# EAGLE design Qwiic_Relay (EAGLE 9.2.0)
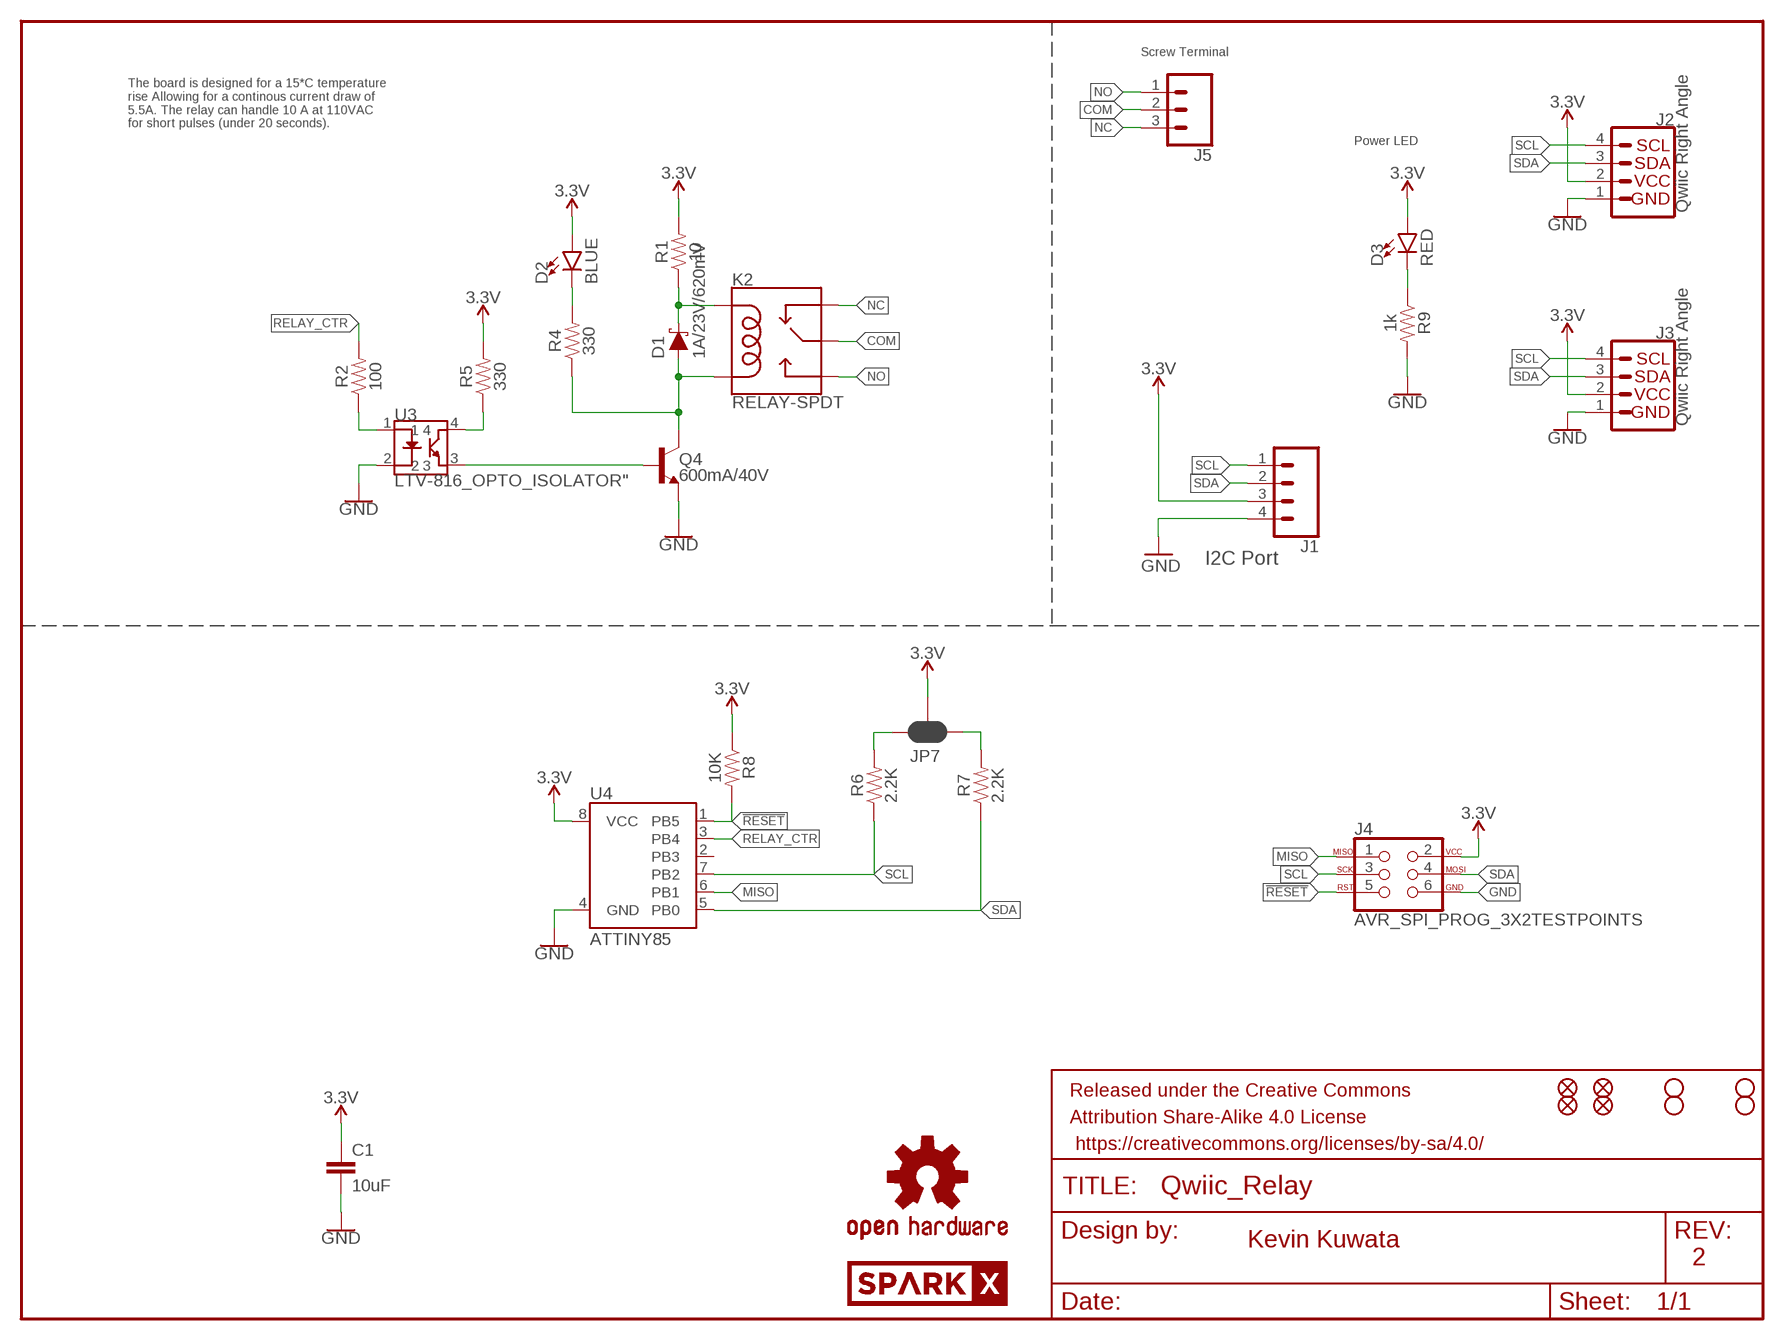
[diagram p0: schematic, sheet 1]

## Parts
C1  10uF  10UF-0603-6.3V-20%  [0603]
D1  1A/23V/620mV  DIODE-SCHOTTKY-BAT20J  [SOD-323]
D2  BLUE  LED-BLUE0603  [LED-0603]
D3  RED  LED-RED0603  [LED-0603]
FRAME1  FRAME-LETTER  [CREATIVE_COMMONS]
J1  CONN_041X04_NO_SILK  [1X04_NO_SILK]
J2  Qwiic Right Angle  I2C_STANDARDQWIIC  [1X04_1MM_RA]
J3  Qwiic Right Angle  I2C_STANDARDQWIIC  [1X04_1MM_RA]
J4  AVR_SPI_PROG_3X2TESTPOINTS  [2X3_TEST_POINTS]
J5  CONN_03-SCREW-5MM  [SCREWTERMINAL-5MM-3]
JP1  STAND-OFF  [STAND-OFF]
JP2  FIDUCIALUFIDUCIAL  [MICRO-FIDUCIAL]
JP3  STAND-OFF  [STAND-OFF]
JP4  STAND-OFF  [STAND-OFF]
JP5  STAND-OFF  [STAND-OFF]
JP6  FIDUCIALUFIDUCIAL  [MICRO-FIDUCIAL]
JP7  JUMPER-SMT_3_2-NC_PASTE_SILK  [SMT-JUMPER_3_2-NC_PASTE_SILK]
JP8  FIDUCIALUFIDUCIAL  [MICRO-FIDUCIAL]
JP9  FIDUCIALUFIDUCIAL  [MICRO-FIDUCIAL]
K2  RELAY-SPDT  [RELAY_G5LE]
LOGO1  OSHW-LOGOMINI  [OSHW-LOGO-MINI]
Q4  600mA/40V  TRANS_NPN-MMBT2222AL  [SOT23-3]
R1  10  47KOHM-0603-1/10W-1%  [0603]
R2  100  100OHM-0603-1/4W-5%  [0603]
R4  330  300OHM-0603-1/10W-1%  [0603]
R5  330  330OHM-0603-1/10W-1%  [0603]
R6  2.2K  4.7KOHM-0603-1/10W-1%  [0603]
R7  2.2K  4.7KOHM-0603-1/10W-1%  [0603]
R8  10K  330OHM-0603-1/10W-1%  [0603]
R9  1k  330OHM-0603-1/10W-1%  [0603]
U3  LTV-816_OPTO_ISOLATOR"  [LTV-816_4PIN_DIP]
U4  ATTINY85  [ATTINY85]
U$3  SPARKX-LOGO4  [SPARKX-MEDIUM]
U$4  SPARKX-LOGO4  [SPARKX-MEDIUM]

## Nets
3.3V: C1.1 D2.A D3.A J1.3 J2.2 J3.2 J4.2 JP7.2 R1.2 R5.2 R8.1 U4.8(VCC)
!RESET: J4.5 R8.2 U4.1(PB5)
COM: J5.2 K2.1(MAIN)
GND: C1.2 J1.4 J2.1 J3.1 J4.6 Q4.2(E) R9.2 U3.2 U4.4(GND)
MISO: J4.1 U4.6(PB1)
N$1: Q4.1(B) U3.3
N$2: D1.A K2.5(COIL2) Q4.3(C) R4.1
N$3: R2.1 U3.1
N$4: JP7.1 R7.2
N$7: D1.C K2.2(COIL1) R1.1
N$8: D2.C R4.2
N$9: R5.1 U3.4
N$10: JP7.3 R6.2
N$13: D3.C R9.1
NC: J5.3 K2.4(NC)
NO: J5.1 K2.3(NO)
RELAY_CTR: R2.2 U4.3(PB4)
SCL: J1.1 J2.4 J3.4 J4.3 R6.1 U4.7(PB2)
SDA: J1.2 J2.3 J3.3 J4.4 R7.1 U4.5(PB0)
Unconnected: U4.2(PB3)

## Notes on the sheet
- Screw Terminal
- The board is designed for a 15*C temperature 
  rise Allowing for a continous current draw of 
  5.5A. The relay can handle 10 A at 110VAC 
  for short pulses (under 20 seconds).
- Power LED
- I2C Port
- Kevin Kuwata
- 2

## Library data of the parts
C1 = SparkFun-Capacitors:10UF: 10.0µF ceramic capacitors A capacitor is a passive two-terminal electrical component used to store electrical energy temporarily in an electric field.; PROD_ID: CAP-11015
D1 = SparkFun-DiscreteSemi:DIODE-SCHOTTKY: Schottky diode A Schottky diode is a semiconductor diode which has a low forward voltage drop and a very fast switching action.; PROD_ID: DIO-11623
D2 = SparkFun-LED:LED-BLUE: Blue SMD LED Used in manufacturing of various products at SparkFun Packages: 0603 - SMD 0603 package [Product Link] <http://www.digikey.com/product-detail/en/SMLE12BC7TT86/511-1589-2-ND/1641808> 1206 - SMD1206 package [Product Link] <http://www.digikey.com/product-detail/en/lite-on-inc/LTST-C150TBKT/160-1643-1-ND/573584> SparkFun Products: ESP8266 Thing-Dev Board <https://www.sparkfun.com/products/13711> RedBoard <https://www.sparkfun.com/products/12757>; PROD_ID: DIO-08575
D3 = SparkFun-LED:LED-RED: Red SMD LED Used in manufacturing of most products at SparkFun Packages: 0603 - SMD 0603 package [Product Link] <http://docs.avagotech.com/docs/AV02-0551EN> 0603 SMART - SMD 0603 SMART package ( more efficient and expensive)[Product Link] <http://www.osram-os.com/Graphics/XPic2/00077099_0.pdf> 1206 - SMD1206 package [Product Link] <https://www.sparkfun.com/datasheets/DevTools/LilyPad/Q150OVS4.pdff> SparkFun Products: Pro Mini 328 -5V <https://www.sparkfun.com/products/821> RedBoard <https://www.sparkfun.com/products/12757> IOIO-OTG <https://www.sparkfun.com/products/13613>; PROD_ID: DIO-00819
FRAME1 = SparkFun-Aesthetics:FRAME-LETTER: Schematic Frame - Letter Standard 8.5x11 US Letter frame
J1 = SparkFun-Connectors:CONN_04: Multi connection point. Often used as Generic Header-pin footprint for 0.1 inch spaced/style header connections On any of the 0.1 inch spaced packages, you can populate with these: Break Away Headers - Straight <https://www.sparkfun.com/products/116> (PRT-00116) Break Away Male Headers - Right Angle <https://www.sparkfun.com/products/553> (PRT-00553) Female Headers <https://www.sparkfun.com/products/115> (PRT-00115) Break Away Headers - Machine Pin <https://www.sparkfun.com/products/117> (PRT-00117) Break Away Female Headers - Swiss Machine Pin <https://www.sparkfun.com/products/743> (PRT-00743) For SCREWTERMINALS and SPRING TERMINALS visit here: Screw Terimnals on SparkFun.com <https://www.sparkfun.com/search/results?term=Screw+Terminals> (5mm/3.5mm/2.54mm spacing) This device is also useful as a general connection point to wire up your design to another part of your project. Our various solder wires solder well into these plated through hole pads. Hook-Up Wire - Assortment (Stranded, 22 AWG) <https://www.sparkfun.com/products/11375> (PRT-11375) Hook-Up Wire - Assortment (Solid Core, 22 AWG) <https://www.sparkfun.com/products/11367> (PRT-11367) View the entire wire category on our website here <https://www.sparkfun.com/categories/141> Special notes: Molex polarized connector foot print use with SKU : PRT-08231 with associated crimp pins and housings. 1MM SMD Version SKU: PRT-10208; PROD_ID: CONN-09696
J2 J3 = SparkFun-Connectors:I2C_STANDARD: SparkFun I2C Standard Pinout Header SparkFun has standardized on a pinout for all I2C based sensor breakouts. This pinout allows I2C boards to be plugged directly into the headers on Arduino Uno compatible boards, and to be daisy chained easily. Example SparkFun Products: SparkFun Atmospheric Sensor Breakout - BME280 <https://www.sparkfun.com/products/13676> SparkFun Altitude/Pressure Sensor Breakout - MPL3115A2 <https://www.sparkfun.com/products/11084> SparkFun TOF Range Finder Sensor - VL6180 <https://www.sparkfun.com/products/12785>; PROD_ID: CONN-13694
J4 = SparkFun-Connectors:AVR_SPI_PROG_3X2: AVR ISP 6 Pin This is the reduced ISP connector for AVR programming. Common on Arduino. This footprint will take up less PCB space and can be used with a 10-pin to 6-pin adapter such as SKU: BOB-08508 **Special note about "TEST_POINT" package. The stop mask is on the top side, so if you want your programming test points to be on the bottom of your board, make sure to place this package on the bottom side of the board. This also ensure that the orientation to program from the bottom side will be correct. SparkFun Products: SparkFun ISP Pogo Adapter <https://www.sparkfun.com/products/11591> - NS Tiny AVR Programmer <https://www.sparkfun.com/products/11801> -PTH
J5 = SparkFun-Connectors:CONN_03: Multi connection point. Often used as Generic Header-pin footprint for 0.1 inch spaced/style header connections On any of the 0.1 inch spaced packages, you can populate with these: Break Away Headers - Straight <https://www.sparkfun.com/products/116> (PRT-00116) Break Away Male Headers - Right Angle <https://www.sparkfun.com/products/553> (PRT-00553) Female Headers <https://www.sparkfun.com/products/115> (PRT-00115) Break Away Headers - Machine Pin <https://www.sparkfun.com/products/117> (PRT-00117) Break Away Female Headers - Swiss Machine Pin <https://www.sparkfun.com/products/743> (PRT-00743) Stackable Header - 3 Pin (Female, 0.1") <https://www.sparkfun.com/products/13875> (PRT-13875) For SCREWTERMINALS and SPRING TERMINALS visit here: Screw Terimnals on SparkFun.com <https://www.sparkfun.com/search/results?term=Screw+Terminals> (5mm/3.5mm/2.54mm spacing) This device is also useful as a general connection point to wire up your design to another part of your project. Our various solder wires solder well into these plated through hole pads. Hook-Up Wire - Assortment (Stranded, 22 AWG) <https://www.sparkfun.com/products/11375> (PRT-11375) Hook-Up Wire - Assortment (Solid Core, 22 AWG) <https://www.sparkfun.com/products/11367> (PRT-11367) View the entire wire category on our website here <https://www.sparkfun.com/categories/141> Special notes: Molex polarized connector foot print use with SKU : PRT-08232 with associated crimp pins and housings.; PROD_ID: CONN-10134; SF_SKU: PRT-08433
JP1 JP3-JP5 = SparkFun:STAND-OFF: Stand Off This is the mechanical footprint for a #4 phillips button head screw. Use the keepout ring to avoid running the screw head into surrounding components. SKU : PRT-00447
JP2 JP6 JP8 JP9 = SparkFun:FIDUCIAL: Fiducial Alignment Points Various fiducial points for machine vision alignment.
JP7 = SparkFun-Jumpers:JUMPER-SMT_3_2-NC_PASTE: Normally closed solder jumper (2 of 2 connections) This jumper has an aperture in the stencil to allow solder paste to bridge both connections. Both connections are normally closed (NC). Wick off the solder to open the connection(s). Reapply solder to reclose the connection(s).
K2 = SparkFun-Electromechanical:RELAY-SPDT: SPDT Electromechanical Relay Single-pole, double-throw sealed relays. When current is applied to the coil, it throws a simple changeover switch, terminating the connection from the NC contact to ground and closing the NO contact. Use them to switch high voltage/high current devices. SparkFun Products JQX-15F: Relay SPDT Sealed - 20A <https://www.sparkfun.com/products/10924> (COM-10924) JZC-11F: Relay SPDT Sealed <https://www.sparkfun.com/products/100> (COM-00100); PROD_ID: COM-14146
LOGO1 = SparkFun-Aesthetics:OSHW-LOGO: Open-Source Hardware (OSHW) Logo This logo indicates the piece of hardware it is found on incorporates a OSHW license and/or adheres to the definition of open source hardware found here: http://freedomdefined.org/OSHW
Q4 = SparkFun-DiscreteSemi:TRANS_NPN: NPN transistor Current controlled devices typically used to amplify current or used as a switch. BC547 - COM-08928 <http://www.sparkfun.com/products/8928> (TO-92 45V 100mA) (1.Collector 2.Base 3.Emitter) 2N3904 - COM-00521 <http://www.sparkfun.com/products/521> (TO-92 40V 200mA) (1.Emitter 2.Base 3.Collector) P2N2222A - COM-12852 <http://www.sparkfun.com/products/12852> (TO-92 40V 600mA) (1.Collector 2.Base 3.Emitter); PROD_ID: TRANS-08049
R1 = SparkFun-Resistors:47KOHM: 47kΩ resistor A resistor is a passive two-terminal electrical component that implements electrical resistance as a circuit element. Resistors act to reduce current flow, and, at the same time, act to lower voltage levels within circuits. - Wikipedia; PROD_ID: RES-07871; VALUE: 47k
R2 = SparkFun-Resistors:100OHM: 100Ω resistor A resistor is a passive two-terminal electrical component that implements electrical resistance as a circuit element. Resistors act to reduce current flow, and, at the same time, act to lower voltage levels within circuits. - Wikipedia; PROD_ID: RES-12438
R4 = SparkFun-Resistors:300OHM: 300Ω resistor A resistor is a passive two-terminal electrical component that implements electrical resistance as a circuit element. Resistors act to reduce current flow, and, at the same time, act to lower voltage levels within circuits. - Wikipedia; PROD_ID: RES_10328; VALUE: 300
R5 = SparkFun-Resistors:330OHM: 330Ω resistor A resistor is a passive two-terminal electrical component that implements electrical resistance as a circuit element. Resistors act to reduce current flow, and, at the same time, act to lower voltage levels within circuits. - Wikipedia; PROD_ID: RES-00818
R6 R7 = SparkFun-Resistors:4.7KOHM: 4.7kΩ resistor A resistor is a passive two-terminal electrical component that implements electrical resistance as a circuit element. Resistors act to reduce current flow, and, at the same time, act to lower voltage levels within circuits. - Wikipedia; PROD_ID: RES-07857; VALUE: 4.7k
R8 R9 = SparkFun-Resistors:330OHM: 330Ω resistor A resistor is a passive two-terminal electrical component that implements electrical resistance as a circuit element. Resistors act to reduce current flow, and, at the same time, act to lower voltage levels within circuits. - Wikipedia; PROD_ID: RES-00818; VALUE: 330
U3 = SparkFun-DiscreteSemi:LTV-816_OPTO_ISOLATOR; PROD_ID: IC-14145
U4 = SparkFun-IC-Microcontroller:ATTINY85; PROD_ID: IC-09092
U$3 U$4 = SparkX:SPARKX-LOGO

## Board
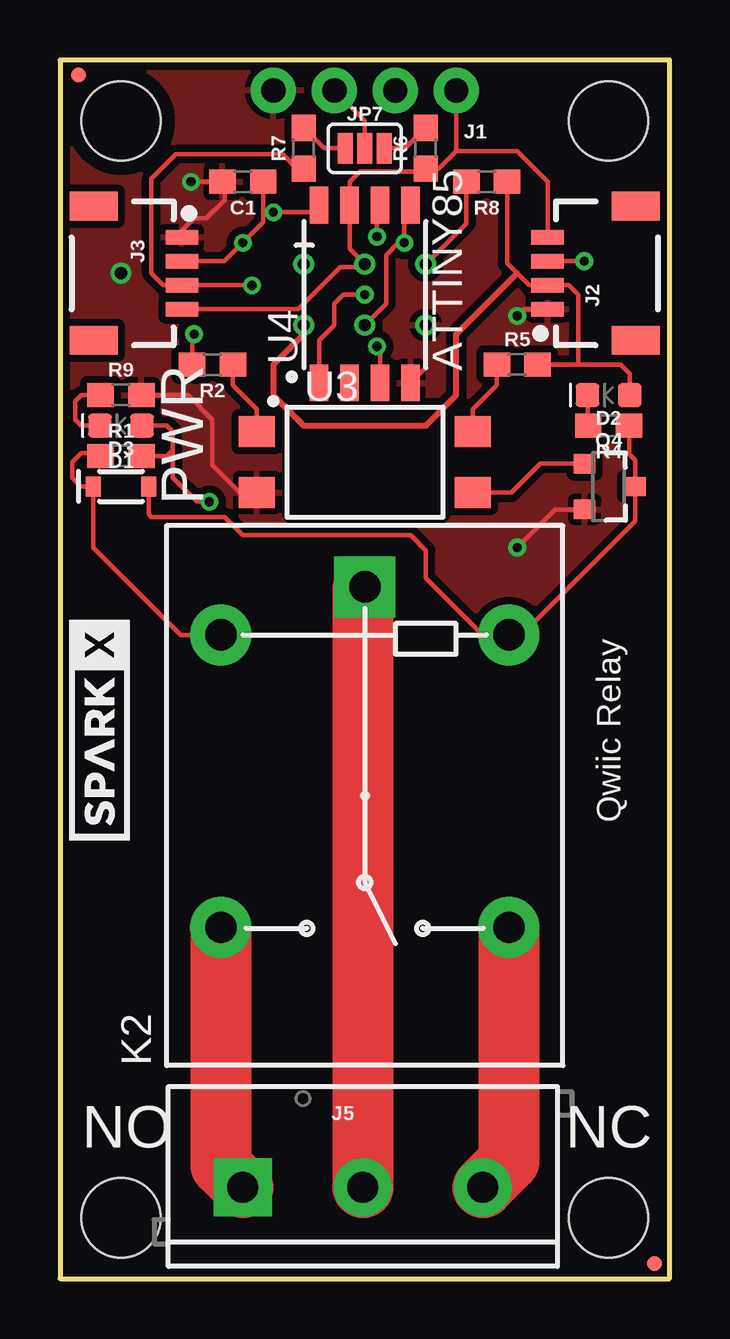
[diagram p1: board, top side]
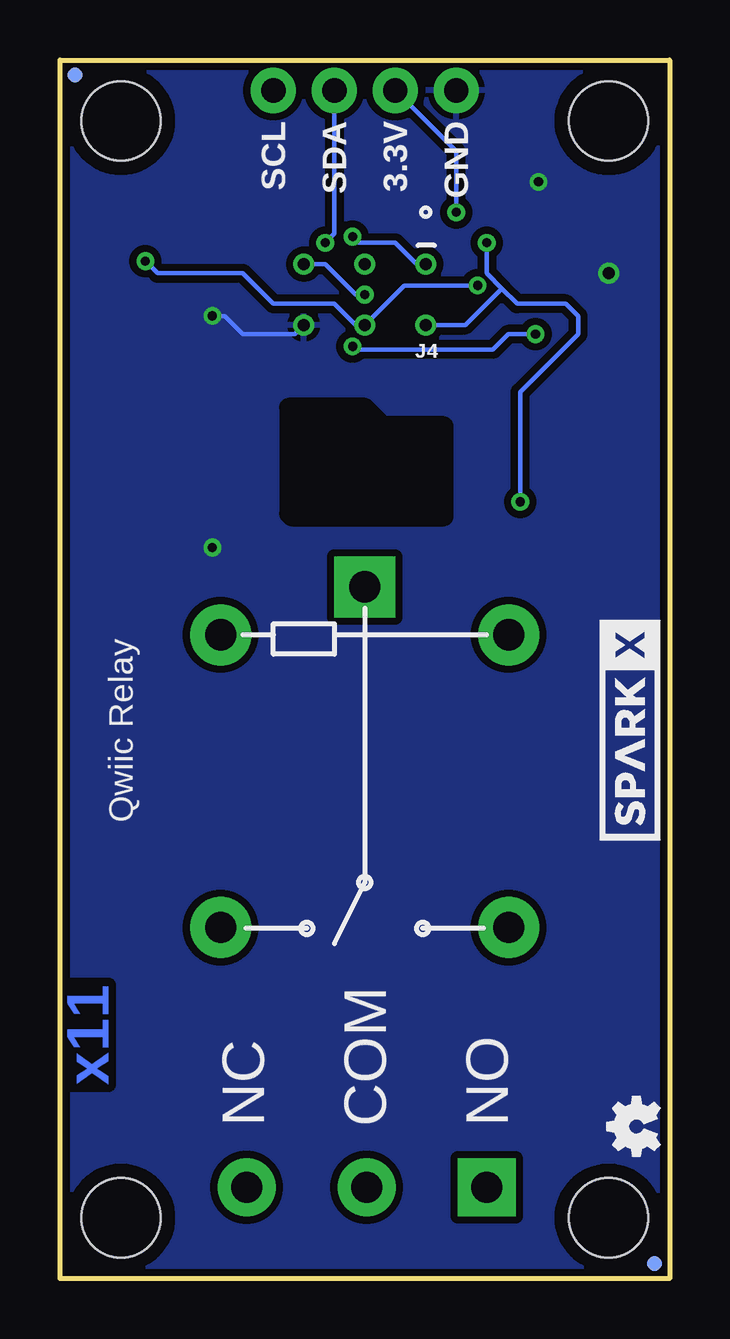
[diagram p2: board, bottom side, seen from below]

Size 25.4 x 50.8 mm. Coordinates in mm from the lower left corner, seen from the top.
Outline: 0,0 25.4,0 25.4,50.8 0,50.8 0,0
Copper layers (1*16): Top 0.035mm / dielectric 1.5mm / Bottom 0.035mm
Design rules "SparkFun-2-layer-PCBWay-LIMIT": minimum track width 6mil, minimum drill 0.3mm, track to track 6mil, track to pad 6mil, pad to pad 6mil, via to via 6mil, smd to smd 6mil, copper to edge 6mil, drill to drill 6mil, minimum pad ring 7mil, minimum via ring 7mil, stop-mask expansion 4mil, vias tented up to drill 25mil, thermal gap 10mil
tKeepout: area 9.7,31.8 to 15.9,35.7
tRestrict: area 9.4,31.9 to 15.9,36.3
bRestrict: area 9.4,31.8 to 15.9,36.3

### Footprints (pad centres in the part's own frame; a part is rotated, then mirrored left to right if it is on the bottom)
0603 = smd 1.1 x 1: 1 -0.85,0; 2 0.85,0
SOD-323 = smd 0.63 x 0.83: A 1.15,0; C -1.15,0
LED-0603 = smd 1 x 1: A -0.877,0; C 0.877,0
1X04_NO_SILK = drill 1.016 pad 1.88: 1 0,0; 2 2.54,0; 3 5.08,0; 4 7.62,0
1X04_1MM_RA = smd 0.6 x 1.35: 1 -1.5,0; 2 -0.5,0; 3 0.5,0; 4 1.5,0 | smd 1.2 x 2: NC1 2.8,-3.675; NC2 -2.8,-3.675
2X3_TEST_POINTS = drill 0.508: 1 -2.54,-1.27; 2 -2.54,1.27; 3 0,-1.27; 4 0,1.27; 5 2.54,-1.27; 6 2.54,1.27
SCREWTERMINAL-5MM-3 = drill 1.3 pad 2.413 square: 1 0,0 | drill 1.3 pad 2.413: 2 5,0; 3 10,0
STAND-OFF = hole 3.302: 0,0
MICRO-FIDUCIAL = smd 0.635 x 0.635: 1 0,0
SMT-JUMPER_3_2-NC_PASTE_SILK = smd 0.635 x 1.27: 1 -0.813,0; 2 0,0; 3 0.813,0
RELAY_G5LE = drill 1.3 pad 2.54 square: 1 8.52,-0.005 | drill 1.3 pad 2.54: 2 6.52,5.995; 3 -5.68,5.995; 4 -5.68,-6.005; 5 6.52,-6.005
SOT23-3 = smd 0.8 x 0.9: 1 -0.95,-1; 2 0.95,-1; 3 0,1.1
LTV-816_4PIN_DIP = smd 1.5 x 1.3: 1 -4.5,1.27; 2 -4.5,-1.27; 3 4.5,-1.27; 4 4.5,1.27
ATTINY85 = smd 1.524 x 0.762: 1 -3.683,1.905; 2 -3.683,0.635; 3 -3.683,-0.635; 4 -3.683,-1.905; 5 3.727,-1.905; 6 3.727,-0.635; 7 3.727,0.635; 8 3.727,1.905

### Placement (x,y rotation side)
C1  7.62,45.72 180 top
D1  2.54,33.02 0 top
D2  22.86,36.83 180 top
D3  2.54,35.56 180 top
FRAME1  10.16,-16.51 0 top  (outside the outline)
J1  16.51,49.53 180 top
J2  20.32,41.91 90 top
J3  5.08,41.91 270 top
J4  12.7,41.02 180 bottom
J5  7.62,3.81 0 top
JP1  2.54,2.54 0 top
JP2  24.77,50.16 0 bottom
JP3  2.54,48.26 0 top
JP4  22.86,48.26 0 top
JP5  22.86,2.54 0 top
JP6  0.64,0.64 0 bottom
JP7  12.7,47.12 0 top
JP8  24.77,0.64 0 top
JP9  0.76,50.16 0 top
K2  12.7,20.32 90 top
LOGO1  1.4,6.35 90 bottom
Q4  22.86,33.02 270 top
R1  2.54,34.29 0 top
R2  6.35,38.1 180 top
R4  22.86,35.56 180 top
R5  19.05,38.1 0 top
R6  15.24,47.12 90 top
R7  10.16,47.12 90 top
R8  17.78,45.72 180 top
R9  2.54,36.83 0 top
U3  12.7,34.04 0 top
U4  12.7,41.02 90 top
U$3  1.65,22.86 90 top
U$4  1.65,22.86 90 bottom

### Tracks (layer width: path | path; a pad name or v marks a point on that pad's centre or on a via)
3.3V  (via drill 0.38)
  Top 0.178: R5.2 21.59,38.1 | 21.59,38.1 23.37,38.1 23.74,37.73 D2.A | J3.2 6.85,42.41 v7.62,43.18 8.47,44.03 8.47,44.45 | C1.1 8.47,44.45 | R8.1 18.63,42.33 19.05,41.91 19.55,41.41 J2.2 21.2,41.41 21.59,41.02 21.59,38.1 | R1.2 4.45,34.29 4.7,34.54 | 4.7,34.54 4.7,35.31 4.45,35.56 D3.A | 4.7,34.54 4.7,33.4 5.71,32.38 v6.22,32.38 | J1.3 12.7,48.26 JP7.2 | 8.47,44.45 v8.89,44.45 10.5,44.45 U4.8
  Top 0.254: J4.2 10.16,39.37 8.89,38.1 8.89,36.83 10.16,35.56 15.24,35.56 16.51,36.83 16.51,39.37 19.05,41.91
  Bottom 0.178: v6.22,32.38 6.22,36.96 3.81,39.37 3.81,40.13 4.32,40.64 6.35,40.64 6.99,41.27 | v7.62,43.18 7.62,41.91 6.99,41.27 | J4.2 8.51,39.75 6.99,41.27 | v8.89,44.45 8.89,46.99 J1.3
!RESET  (via drill 0.38)
  Top 0.178: R8.2 16.93,43.98 J4.5 | v12.7,41.02 11.81,41.02 11.43,40.64 11.43,39.75 10.79,39.12 U4.1
  Bottom 0.178: J4.5 14.35,42.29 13.08,41.02 v12.7,41.02
COM
  Top 2.54: K2.1 12.62,28.75 J5.2
GND  (via drill 0.38, 0.51)
  Top 0.178: J4.6 15.24,37.97 U4.4 | 7.49,32.77 6.35,33.91 6.35,35.81 5.33,36.83 R9.2 | Q4.2 20.64,32.07 v19.05,30.48 | J3.1 5.08,43.69 5.59,44.2 6.1,44.2 6.86,44.96 6.86,45.63 C1.2 v5.46,45.72 | J2.1 19.33,40.41 v19.05,40.13
  Bottom 0.178: v19.05,40.13 18.54,40.13 17.78,39.37 15.62,39.37 J4.6
  other vias: 2.54,41.91
  pour Top (isolate 0.305): 0,0 0,50.8 25.4,50.8 25.4,0
  pour Bottom (isolate 0.305): 0,0 25.4,0 25.4,50.8 0,50.8
MISO  (via drill 0.38)
  Top 0.178: U4.6 13.21,44.62 v13.21,43.43
  Bottom 0.178: J4.1 10.54,42.29 11.43,43.18 12.95,43.18 v13.21,43.43
N$1
  Top 0.178: Q4.1 20,33.97 18.8,32.77 U3.3
N$2
  Top 0.178: D1.A 3.69,31.87 3.81,31.75 6.86,31.75 7.62,30.99 14.61,30.99 15.24,30.35 15.24,29.21 17.61,26.84 K2.5 19.22,26.84 23.96,31.58 Q4.3 23.96,34.12 23.71,34.37 R4.1
N$3
  Top 0.178: R2.1 7.2,37.25 8.2,36.25 U3.1
N$4
  Top 0.178: JP7.1 11.01,47.12 R7.2
N$7
  Top 0.178: R1.1 1.56,34.42 0.89,34.42 0.51,34.04 0.51,33.4 0.89,33.02 D1.C 1.39,30.49 5.04,26.84 K2.2
N$8
  Top 0.178: D2.C 21.98,35.59 R4.2
N$9
  Top 0.178: R5.1 18.2,37.25 17.2,36.25 U3.4
N$10
  Top 0.178: JP7.3 14.39,47.12 R6.2
N$13
  Top 0.178: D3.C 0.89,35.56 0.64,35.81 0.64,36.58 0.89,36.83 R9.1
NC
  Top 2.54: J5.3 18.7,4.89 K2.4
NO
  Top 2.54: J5.1 6.71,4.72 K2.3
RELAY_CTR  (via drill 0.38)
  Top 0.178: R2.2 5.5,39.28 v5.59,39.37 | U4.3 13.34,38.73
  Top 0.254: 13.34,38.73 v13.21,38.86
  Bottom 0.178: v5.59,39.37 6.73,39.37 7.37,38.73 13.08,38.73 v13.21,38.86
SCL
  Top 0.178: 16.51,46.99 15.79,46.27 R6.1 15.11,46.14 12.48,46.14 12.06,45.72 U4.7 12.06,42.93 J4.3 12.57,42.16 11.68,42.16 9.93,40.41 J3.4 | 16.51,46.99 J1.1 | 16.51,46.99 19.05,46.99 20.32,45.72 J2.4
SDA  (via drill 0.38)
  Top 0.178: J4.4 13.59,40.64 13.59,42.67 14.1,43.18 v14.35,43.18 14.35,44.49 U4.5 | 19.82,42.41 19.83,42.42 v21.84,42.42 | v8,41.4 v7.99,41.41 J3.3 4.31,41.41 3.81,41.91 3.81,45.85 4.83,46.86 9.27,46.86 9.87,46.27 R7.1
  Top 0.254: J2.3 19.82,42.41
  Bottom 0.178: v21.84,42.42 21.34,41.91 17.78,41.91 16.51,40.64 13.97,40.64 13.08,39.75 J4.4 11.05,41.4 v8,41.4 | J1.2 13.97,43.56 v14.35,43.18

### Text on the board
Bottom: x11
tPlace: PWR | Qwiic Relay | NO | NC
bPlace: GND | 3.3V | SDA | SCL | Qwiic Relay | NO | COM | NC
tDocu: The relay is rated for 10A at 110VAC or / 5A at 250VAC. The current is limited by / the FR4 glass transition temperature- typically 135 *C. / Theoretical maximum const current draw is 7A. Pulsed current can be higher. / https://www.qorvo.com/design-hub/design-tools/trace-width-calculator | Max Current 5.5A / 100 mil width / 15 *C Rise / 1 Oz Cu | Kevin Kuwata